# EAGLE schematic FSPad_sch (EAGLE 9.4.2)
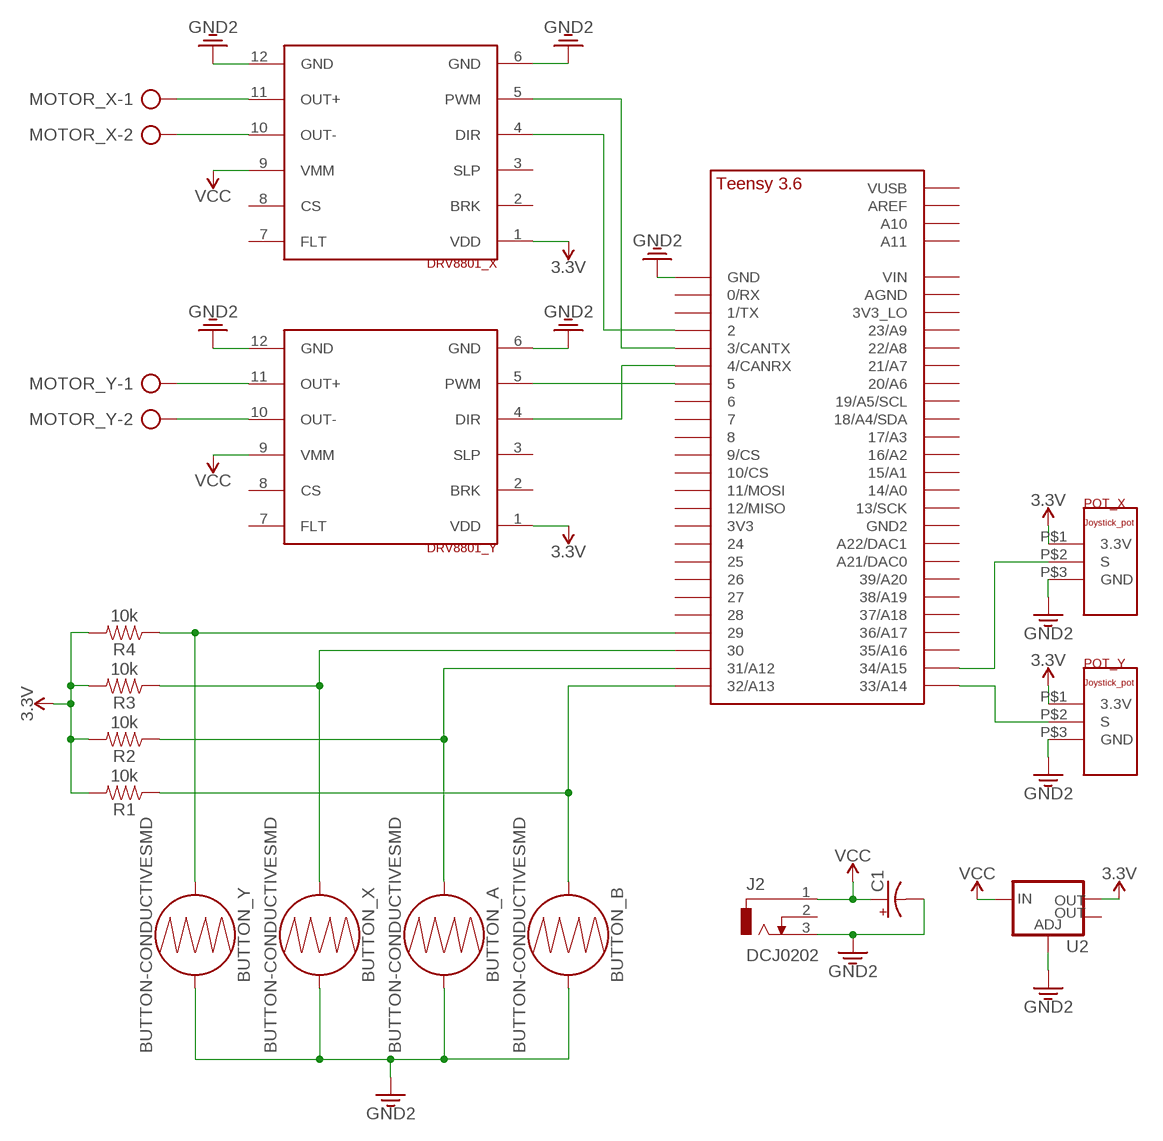
[diagram p0: schematic, sheet 1]

## Parts
BUTTON_A  BUTTON-CONDUCTIVESMD  [BUTTON-CONDUCTIVE]
BUTTON_B  BUTTON-CONDUCTIVESMD  [BUTTON-CONDUCTIVE]
BUTTON_X  BUTTON-CONDUCTIVESMD  [BUTTON-CONDUCTIVE]
BUTTON_Y  BUTTON-CONDUCTIVESMD  [BUTTON-CONDUCTIVE]
C1  1mF  1000UF-RADIAL-5MM-25V-20%  [CPOL-RADIAL-5MM-10MM]
DRV8801_X  DRV8801_BREAKOUT_BOARD  [DRV8801_BREAKOUT_BOARD]
DRV8801_Y  DRV8801_BREAKOUT_BOARD  [DRV8801_BREAKOUT_BOARD]
J2  DCJ0202  [DCJ0202]
MOTOR_X  AK300/2  [AK300/2]
MOTOR_Y  AK300/2  [AK300/2]
POT_X  JOYSTICK_POT  [JOYSTICK_POT]
POT_Y  JOYSTICK_POT  [JOYSTICK_POT]
R1  10k  10KOHM-HORIZ-1/4W-1%  [AXIAL-0.3]
R2  10k  10KOHM-HORIZ-1/4W-1%  [AXIAL-0.3]
R3  10k  10KOHM-HORIZ-1/4W-1%  [AXIAL-0.3]
R4  10k  10KOHM-HORIZ-1/4W-1%  [AXIAL-0.3]
U2  V_REG_LM1117SOT223  [SOT223]
U$1  TEENSY_3.5/3.6_BASIC  [TEENSY_3.5/3.6_BASIC]

## Nets
3.3V: BUTTON_A.2 BUTTON_B.2 BUTTON_X.2 BUTTON_Y.2 C1.- DRV8801_X.1(VDD) DRV8801_X.6(GND) DRV8801_X.12(GND) DRV8801_Y.1(VDD) DRV8801_Y.6(GND) DRV8801_Y.12(GND) J2.3 POT_X.P$1(3.3V) POT_X.P$3(GND) POT_Y.P$1(3.3V) POT_Y.P$3(GND) R1.P$2 R2.P$2 R3.P$2 R4.P$2 U2.1(ADJ) U2.2(OUT) U$1.GND ; supply symbol labelled GND2
N$1: POT_X.P$2(S) U$1.34/A15
N$3: DRV8801_X.4(DIR) U$1.2
N$4: DRV8801_X.5(PWM) U$1.3/CANTX
N$5: DRV8801_Y.4(DIR) U$1.4/CANRX
N$6: DRV8801_Y.5(PWM) U$1.5
N$7: BUTTON_Y.1 R4.P$1 U$1.29
N$8: POT_Y.P$2(S) U$1.33/A14
N$9: BUTTON_X.1 R3.P$1 U$1.30
N$10: BUTTON_A.1 R2.P$1 U$1.31/A12
N$11: BUTTON_B.1 R1.P$1 U$1.32/A13
N$16: DRV8801_X.11(OUT+) MOTOR_X.1
N$17: DRV8801_X.10(OUT-) MOTOR_X.2
N$18: DRV8801_Y.11(OUT+) MOTOR_Y.1
N$19: DRV8801_Y.10(OUT-) MOTOR_Y.2
VCC: C1.+ DRV8801_X.9(VMM) DRV8801_Y.9(VMM) J2.1 U2.3(IN)
Unconnected: DRV8801_X.2(BRK) DRV8801_X.3(SLP) DRV8801_X.7(FLT) DRV8801_X.8(CS) DRV8801_Y.2(BRK) DRV8801_Y.3(SLP) DRV8801_Y.7(FLT) DRV8801_Y.8(CS) J2.2 U2.4(OUT) U$1.0/RX U$1.1/TX U$1.3V3 U$1.3V3_LO U$1.6 U$1.7 U$1.8 U$1.9/CS U$1.10/CS U$1.11/MOSI U$1.12/MISO U$1.13/SCK U$1.14/A0 U$1.15/A1 U$1.16/A2 U$1.17/A3 U$1.18/A4/SDA U$1.19/A5/SCL U$1.20/A6 U$1.21/A7 U$1.21/DAC0(A21/DAC0) U$1.22/A8 U$1.23/A9 U$1.24 U$1.25 U$1.26 U$1.27 U$1.28 U$1.35/A16 U$1.36/A17 U$1.37/A18 U$1.38/A19 U$1.39/A20 U$1.A10 U$1.A11 U$1.A22/DAC1 U$1.AGND U$1.AREF U$1.GND2 U$1.VIN U$1.VUSB

## Library data of the parts
BUTTON_A BUTTON_B BUTTON_X BUTTON_Y = SparkFun-Switches:BUTTON-CONDUCTIVE: Conductive Button Used with rubber key pads on the Nordic Key FOB <https://www.sparkfun.com/products/retired/8602>. This one was designed and proven to work with the PolyCase Key FOB enclosures <https://www.sparkfun.com/products/retired/9377>. SparkFun Products Nordic Fob <https://www.sparkfun.com/products/retired/8602> (WRL-08602)
C1 = SparkFun-Capacitors:1000UF: 1,000µF/1mF ceramic capacitors A capacitor is a passive two-terminal electrical component used to store electrical energy temporarily in an electric field. CAP-08070; PROD_ID: CAP-09538
DRV8801_X DRV8801_Y = DRV8801:DRV8801_BREAKOUT_BOARD
J2 = con-jack:DCJ0202: DC POWER JACK Source: DCJ0202.pdf; OC_FARNELL: unknown; OC_NEWARK: unknown
MOTOR_X MOTOR_Y = con-ptr500:AK300/2: CONNECTOR; OC_FARNELL: unknown; OC_NEWARK: unknown
POT_X POT_Y = joystick_pot:JOYSTICK_POT
R1-R4 = SparkFun-Resistors:10KOHM: 10kΩ resistor A resistor is a passive two-terminal electrical component that implements electrical resistance as a circuit element. Resistors act to reduce current flow, and, at the same time, act to lower voltage levels within circuits. - Wikipedia; PROD_ID: RES-12183
U2 = SparkFun-IC-Power:V_REG_LM1117: Voltage Regulator LM1117 Standard adjustable voltage regulator but in SMD form. Spark Fun Electronics SKU : COM-00595; PROD_ID: VREG-08170
U$1 = Teensy356:TEENSY_3.5/3.6_BASIC